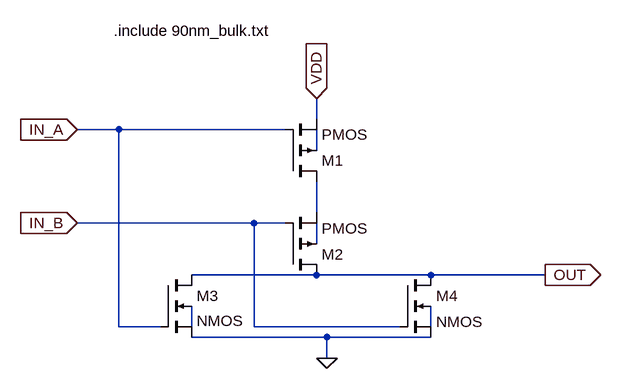
[diagram p0: schematic nor.asc]
nor.asc, the LTspice schematic file:
Version 4
SHEET 1 880 680
WIRE 144 80 144 48
WIRE -160 96 -224 96
WIRE 96 96 -160 96
WIRE 144 128 144 96
WIRE 144 224 144 176
WIRE 48 240 -224 240
WIRE 96 240 48 240
WIRE 144 272 144 240
WIRE 144 320 -48 320
WIRE 320 320 144 320
WIRE 496 320 320 320
WIRE -160 400 -160 96
WIRE -96 400 -160 400
WIRE -48 400 -48 368
WIRE 48 400 48 240
WIRE 272 400 48 400
WIRE 320 400 320 368
WIRE 160 416 -48 416
WIRE 320 416 160 416
WIRE 160 448 160 416
FLAG 160 448 0
FLAG -224 96 IN_A
IOPIN -224 96 In
FLAG -224 240 IN_B
IOPIN -224 240 In
FLAG 144 48 VDD
IOPIN 144 48 In
FLAG 496 320 OUT
IOPIN 496 320 Out
SYMBOL pmos4 96 176 M180
SYMATTR InstName M1
SYMATTR Value2 l=90n w=400n
SYMBOL pmos4 96 320 M180
SYMATTR InstName M2
SYMATTR Value2 l=90n w=400n
SYMBOL nmos4 -96 320 R0
WINDOW 3 56 71 Left 2
SYMATTR InstName M3
SYMATTR Value2 l=90n w=200n
SYMBOL nmos4 272 320 R0
SYMATTR InstName M4
SYMATTR Value2 l=90n w=200n
TEXT -168 -56 Left 2 !.include 90nm_bulk.txt

The netlist it stands for:
* nor.asc
M1 N002 IN_A VDD N001 PMOS l=90n w=400n
M2 OUT IN_B N002 N003 PMOS l=90n w=400n
M3 OUT IN_A 0 N004 NMOS l=90n w=200n
M4 OUT IN_B 0 N005 NMOS l=90n w=200n
.model NMOS NMOS
.model PMOS PMOS
.lib standard.mos
.include 90nm_bulk.txt
.backanno
.end